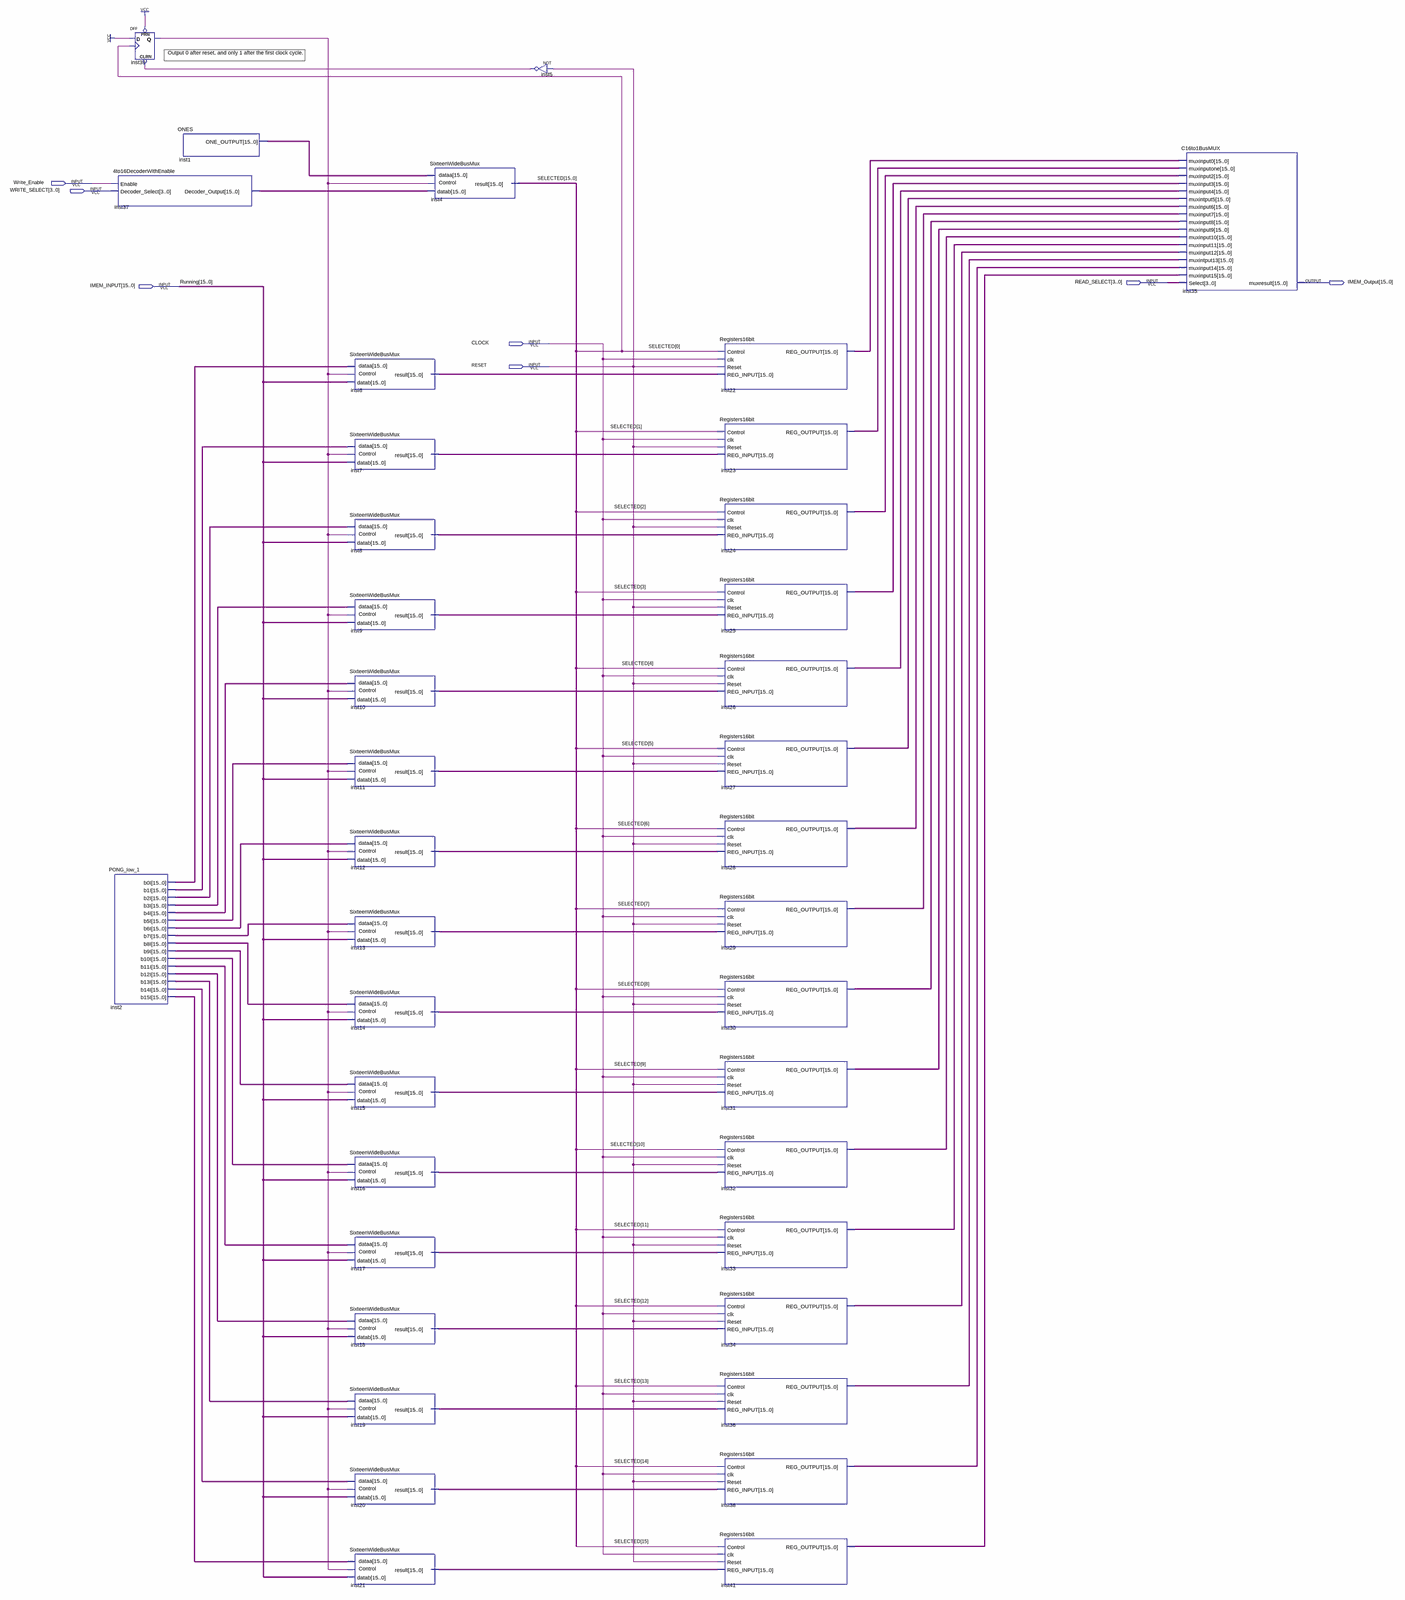
[diagram p0: schematic sheet, whole]
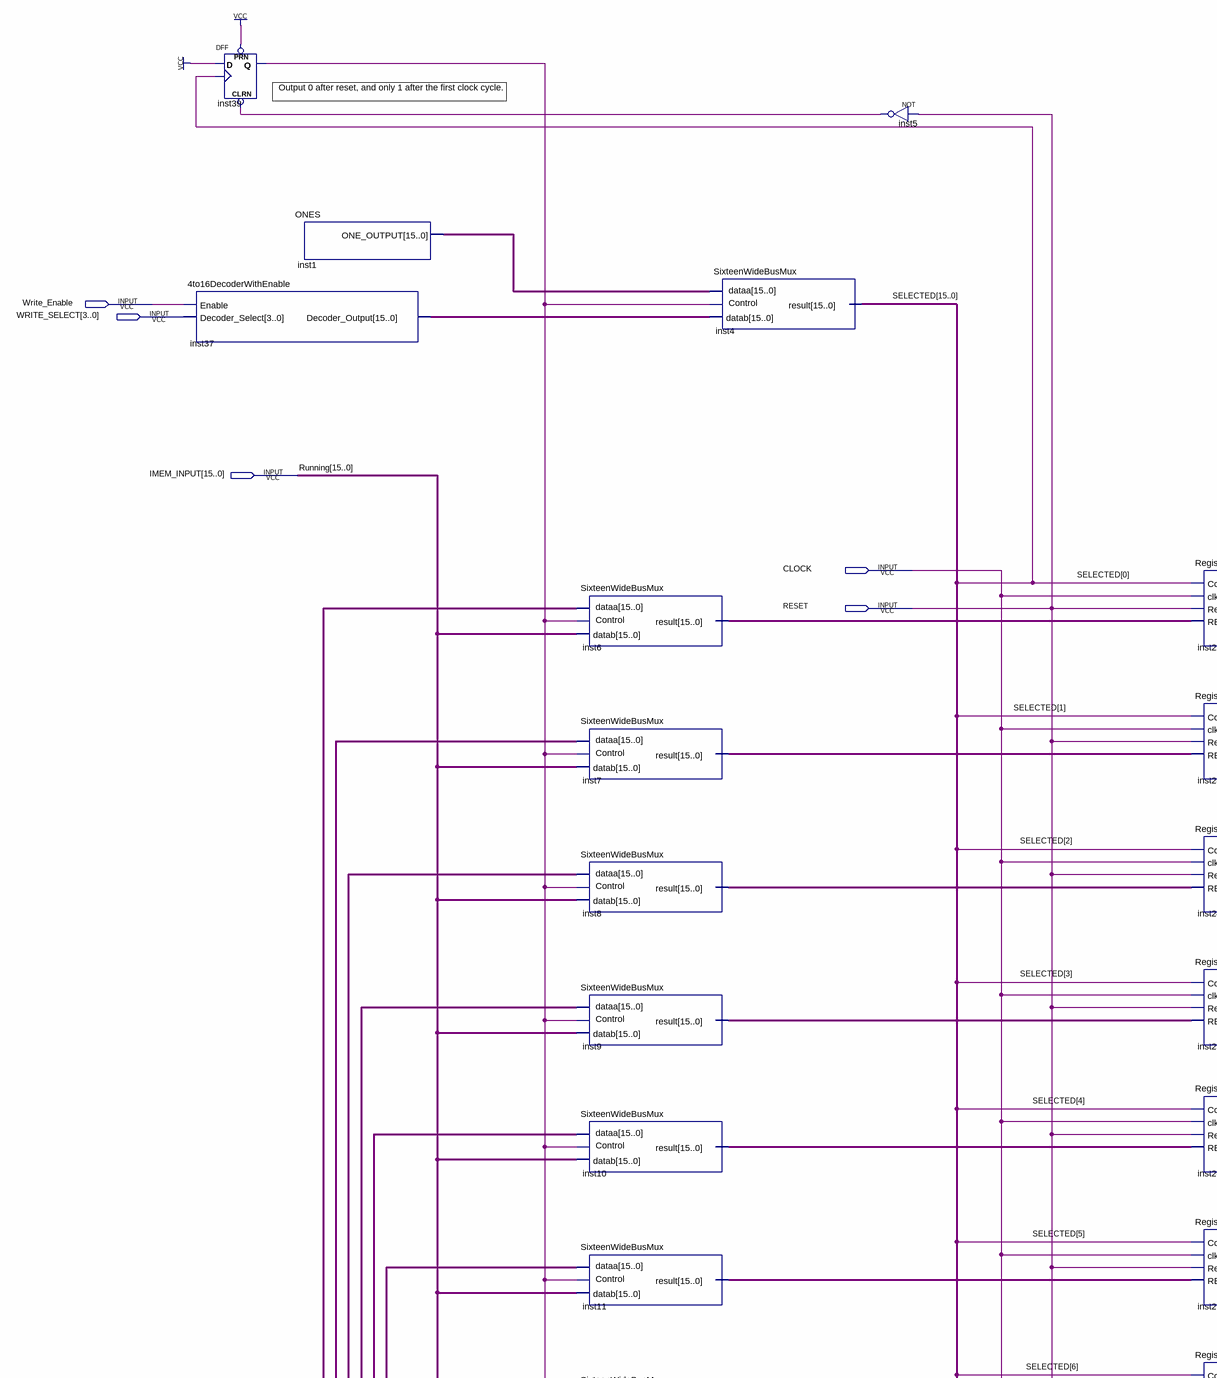
[diagram p1: schematic sheet, upper left part]
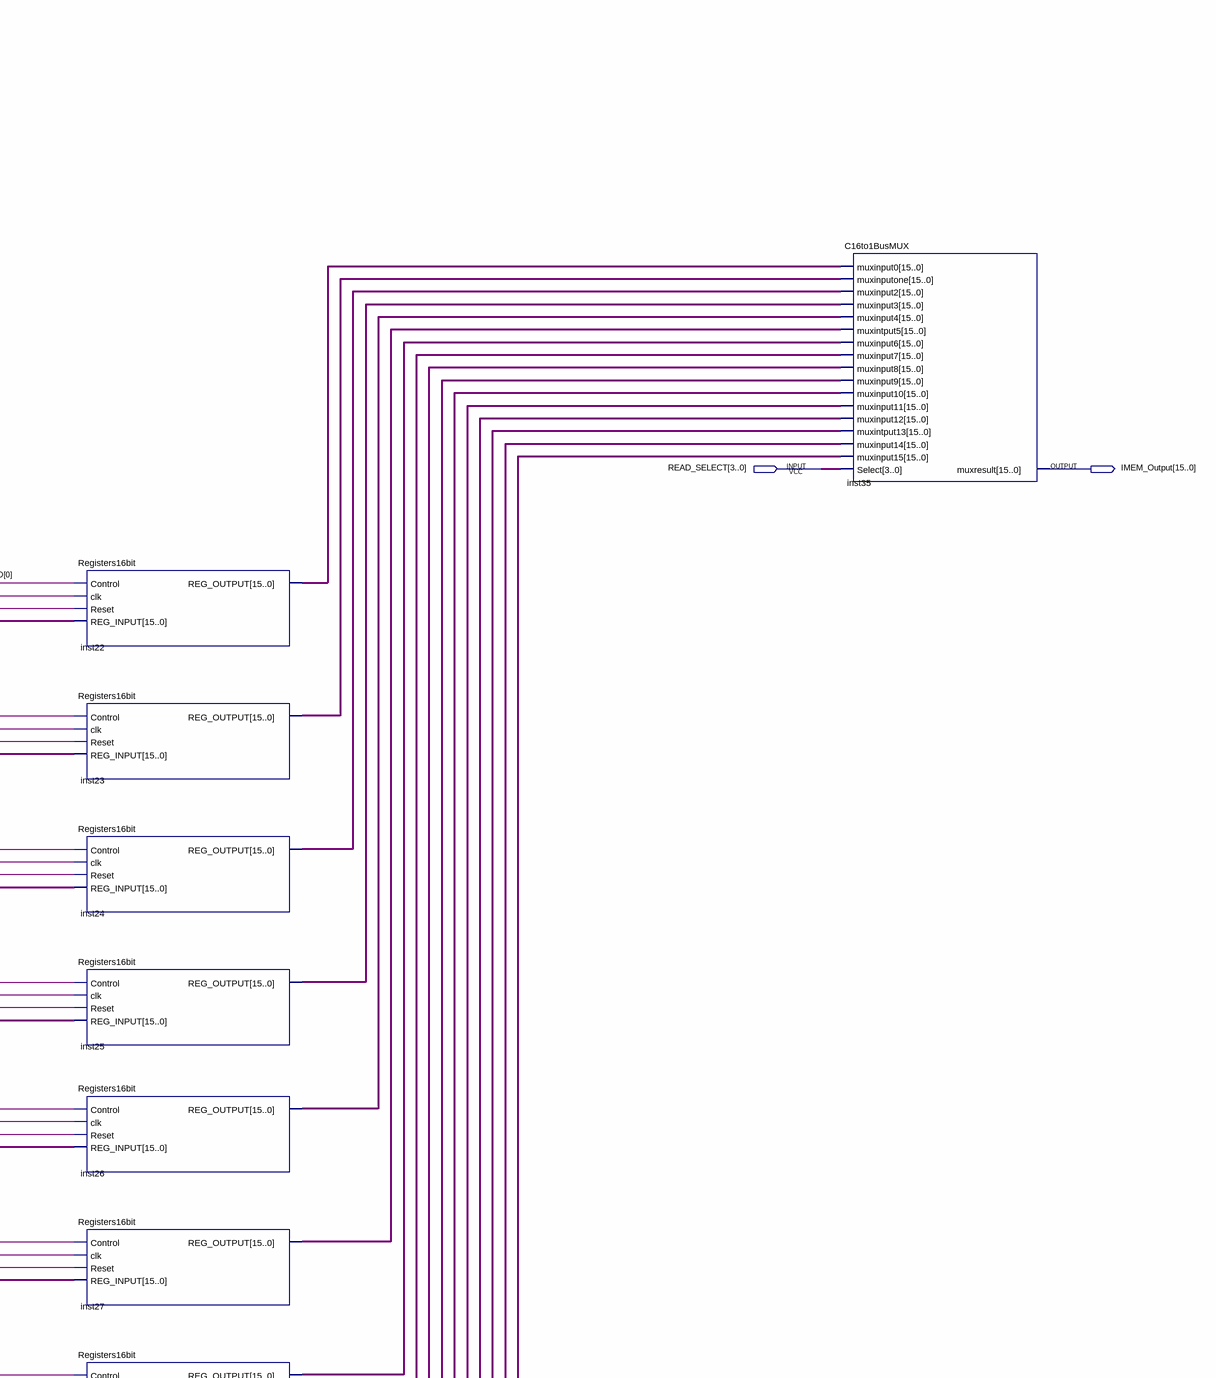
[diagram p2: schematic sheet, upper right part]
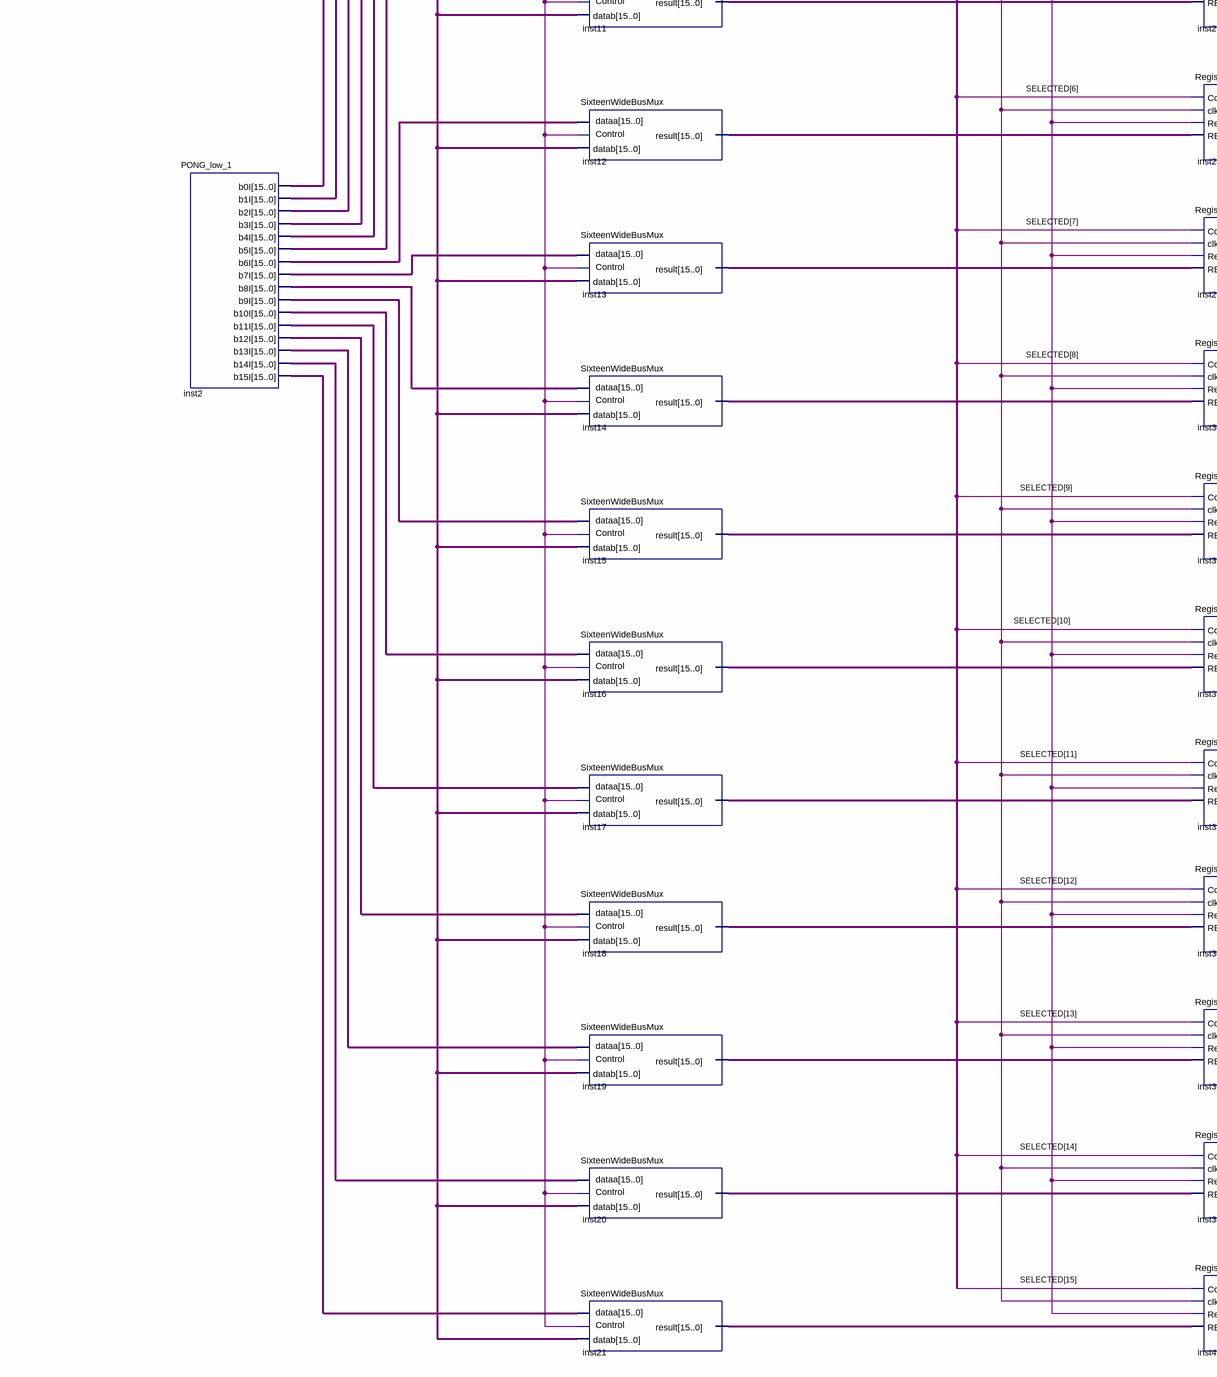
[diagram p3: schematic sheet, lower left part]
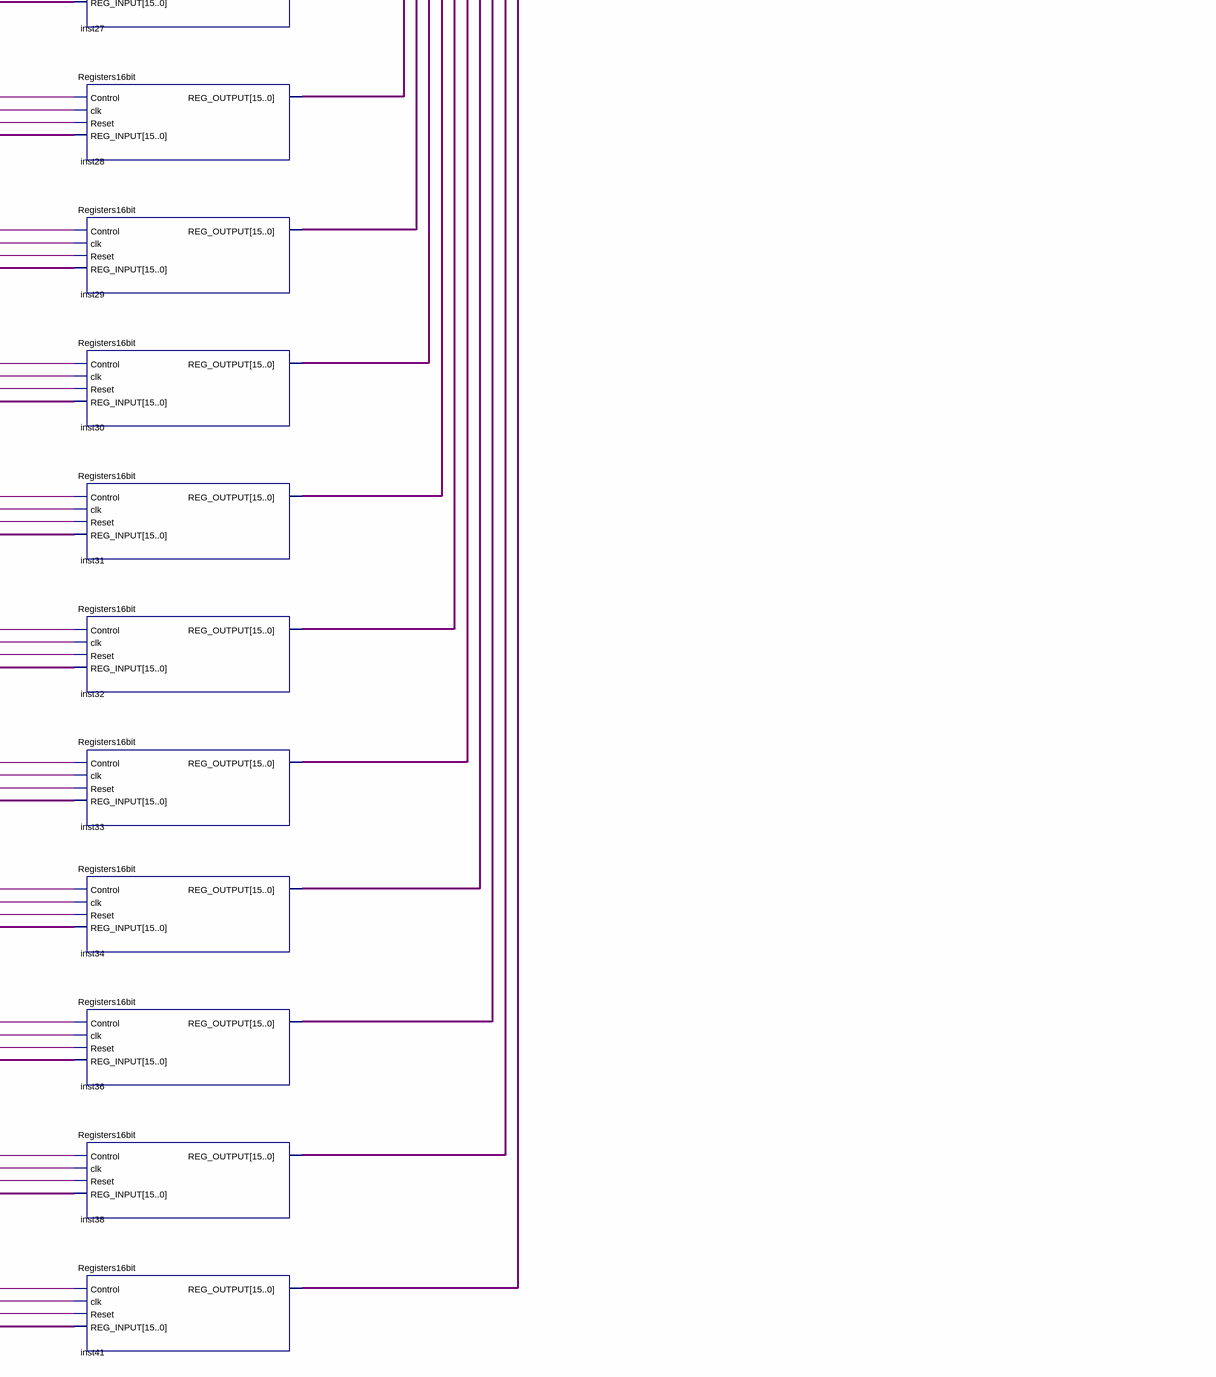
[diagram p4: schematic sheet, lower right part]
// Quartus schematic ReadOnly_16x16_Register_File_Low.bdf as structural Verilog: 39 symbols, 7 pins
module ReadOnly_16x16_Register_File_Low (
  input  Write_Enable,
  input  [3:0] WRITE_SELECT,
  input  [3:0] READ_SELECT,
  input  [15:0] IMEM_INPUT,
  input  CLOCK,
  input  RESET,
  output [15:0] IMEM_Output
);

  wire inst5_out, inst39_q;
  wire [15:0] inst1_one_output, inst2_b0i, inst2_b1i, inst2_b2i, inst2_b3i, inst2_b4i, inst2_b5i, inst2_b6i,
       inst2_b7i, inst2_b8i, inst2_b9i, inst2_b10i, inst2_b11i, inst2_b12i, inst2_b13i, inst2_b14i,
       inst2_b15i, inst6_result, inst7_result, inst8_result, inst9_result, inst10_result, inst11_result,
       inst12_result, inst13_result, inst14_result, inst15_result, inst16_result, inst17_result,
       inst18_result, inst19_result, inst20_result, inst21_result, inst22_reg_output, inst23_reg_output,
       inst24_reg_output, inst25_reg_output, inst26_reg_output, inst27_reg_output, inst28_reg_output,
       inst29_reg_output, inst30_reg_output, inst31_reg_output, inst32_reg_output, inst33_reg_output,
       inst34_reg_output, inst36_reg_output, inst37_decoder_output, inst38_reg_output, inst41_reg_output,
       SELECTED;

  \4to16DecoderWithEnable  inst37 (
    .Enable(Write_Enable), .Decoder_Select(WRITE_SELECT), .Decoder_Output(inst37_decoder_output));
  PONG_low_1 inst2 (
    .b0I(inst2_b0i), .b1I(inst2_b1i), .b2I(inst2_b2i), .b3I(inst2_b3i), .b4I(inst2_b4i), .b5I(inst2_b5i),
    .b6I(inst2_b6i), .b7I(inst2_b7i), .b8I(inst2_b8i), .b9I(inst2_b9i), .b10I(inst2_b10i), .b11I(inst2_b11i),
    .b12I(inst2_b12i), .b13I(inst2_b13i), .b14I(inst2_b14i), .b15I(inst2_b15i));
  DFF inst39 (.CLRN(inst5_out), .CLK(SELECTED[0]), .D(1'b1), .PRN(1'b1), .Q(inst39_q));
  ONES inst1 (.ONE_OUTPUT(inst1_one_output));
  SixteenWideBusMux inst6 (.Control(inst39_q), .dataa(inst2_b0i), .datab(IMEM_INPUT), .result(inst6_result));
  SixteenWideBusMux inst7 (.Control(inst39_q), .dataa(inst2_b1i), .datab(IMEM_INPUT), .result(inst7_result));
  SixteenWideBusMux inst8 (.Control(inst39_q), .dataa(inst2_b2i), .datab(IMEM_INPUT), .result(inst8_result));
  SixteenWideBusMux inst9 (.Control(inst39_q), .dataa(inst2_b3i), .datab(IMEM_INPUT), .result(inst9_result));
  SixteenWideBusMux inst10 (.Control(inst39_q), .dataa(inst2_b4i), .datab(IMEM_INPUT), .result(inst10_result));
  SixteenWideBusMux inst11 (.Control(inst39_q), .dataa(inst2_b5i), .datab(IMEM_INPUT), .result(inst11_result));
  SixteenWideBusMux inst12 (.Control(inst39_q), .dataa(inst2_b6i), .datab(IMEM_INPUT), .result(inst12_result));
  SixteenWideBusMux inst13 (.Control(inst39_q), .dataa(inst2_b7i), .datab(IMEM_INPUT), .result(inst13_result));
  SixteenWideBusMux inst14 (.Control(inst39_q), .dataa(inst2_b8i), .datab(IMEM_INPUT), .result(inst14_result));
  SixteenWideBusMux inst15 (.Control(inst39_q), .dataa(inst2_b9i), .datab(IMEM_INPUT), .result(inst15_result));
  SixteenWideBusMux inst16 (.Control(inst39_q), .dataa(inst2_b10i), .datab(IMEM_INPUT), .result(inst16_result));
  SixteenWideBusMux inst17 (.Control(inst39_q), .dataa(inst2_b11i), .datab(IMEM_INPUT), .result(inst17_result));
  SixteenWideBusMux inst18 (.Control(inst39_q), .dataa(inst2_b12i), .datab(IMEM_INPUT), .result(inst18_result));
  SixteenWideBusMux inst19 (.Control(inst39_q), .dataa(inst2_b13i), .datab(IMEM_INPUT), .result(inst19_result));
  SixteenWideBusMux inst20 (.Control(inst39_q), .dataa(inst2_b14i), .datab(IMEM_INPUT), .result(inst20_result));
  SixteenWideBusMux inst21 (.Control(inst39_q), .dataa(inst2_b15i), .datab(IMEM_INPUT), .result(inst21_result));
  SixteenWideBusMux inst4 (
    .Control(inst39_q), .dataa(inst1_one_output), .datab(inst37_decoder_output), .result(SELECTED));
  not inst5 (inst5_out, RESET);
  Registers16bit inst22 (
    .Control(SELECTED[0]), .clk(CLOCK), .Reset(RESET), .REG_INPUT(inst6_result),
    .REG_OUTPUT(inst22_reg_output));
  Registers16bit inst23 (
    .Control(SELECTED[1]), .clk(CLOCK), .Reset(RESET), .REG_INPUT(inst7_result),
    .REG_OUTPUT(inst23_reg_output));
  Registers16bit inst24 (
    .Control(SELECTED[2]), .clk(CLOCK), .Reset(RESET), .REG_INPUT(inst8_result),
    .REG_OUTPUT(inst24_reg_output));
  Registers16bit inst25 (
    .Control(SELECTED[3]), .clk(CLOCK), .Reset(RESET), .REG_INPUT(inst9_result),
    .REG_OUTPUT(inst25_reg_output));
  Registers16bit inst26 (
    .Control(SELECTED[4]), .clk(CLOCK), .Reset(RESET), .REG_INPUT(inst10_result),
    .REG_OUTPUT(inst26_reg_output));
  Registers16bit inst27 (
    .Control(SELECTED[5]), .clk(CLOCK), .Reset(RESET), .REG_INPUT(inst11_result),
    .REG_OUTPUT(inst27_reg_output));
  Registers16bit inst28 (
    .Control(SELECTED[6]), .clk(CLOCK), .Reset(RESET), .REG_INPUT(inst12_result),
    .REG_OUTPUT(inst28_reg_output));
  Registers16bit inst29 (
    .Control(SELECTED[7]), .clk(CLOCK), .Reset(RESET), .REG_INPUT(inst13_result),
    .REG_OUTPUT(inst29_reg_output));
  Registers16bit inst30 (
    .Control(SELECTED[8]), .clk(CLOCK), .Reset(RESET), .REG_INPUT(inst14_result),
    .REG_OUTPUT(inst30_reg_output));
  Registers16bit inst31 (
    .Control(SELECTED[9]), .clk(CLOCK), .Reset(RESET), .REG_INPUT(inst15_result),
    .REG_OUTPUT(inst31_reg_output));
  Registers16bit inst32 (
    .Control(SELECTED[10]), .clk(CLOCK), .Reset(RESET), .REG_INPUT(inst16_result),
    .REG_OUTPUT(inst32_reg_output));
  Registers16bit inst33 (
    .Control(SELECTED[11]), .clk(CLOCK), .Reset(RESET), .REG_INPUT(inst17_result),
    .REG_OUTPUT(inst33_reg_output));
  Registers16bit inst34 (
    .Control(SELECTED[12]), .clk(CLOCK), .Reset(RESET), .REG_INPUT(inst18_result),
    .REG_OUTPUT(inst34_reg_output));
  Registers16bit inst36 (
    .Control(SELECTED[13]), .clk(CLOCK), .Reset(RESET), .REG_INPUT(inst19_result),
    .REG_OUTPUT(inst36_reg_output));
  Registers16bit inst38 (
    .Control(SELECTED[14]), .clk(CLOCK), .Reset(RESET), .REG_INPUT(inst20_result),
    .REG_OUTPUT(inst38_reg_output));
  Registers16bit inst41 (
    .Control(SELECTED[15]), .clk(CLOCK), .Reset(RESET), .REG_INPUT(inst21_result),
    .REG_OUTPUT(inst41_reg_output));
  C16to1BusMUX inst35 (
    .muxinput0(inst22_reg_output), .muxinputone(inst23_reg_output), .muxinput2(inst24_reg_output),
    .muxinput3(inst25_reg_output), .muxinput4(inst26_reg_output), .muxintput5(inst27_reg_output),
    .muxinput6(inst28_reg_output), .muxinput7(inst29_reg_output), .muxinput8(inst30_reg_output),
    .muxinput9(inst31_reg_output), .muxinput10(inst32_reg_output), .muxinput11(inst33_reg_output),
    .muxinput12(inst34_reg_output), .muxintput13(inst36_reg_output), .muxinput14(inst38_reg_output),
    .muxinput15(inst41_reg_output), .Select(READ_SELECT), .muxresult(IMEM_Output));

  // Other names for the same wires on the sheet: Running[15:0] = IMEM_INPUT

  // Notes on the sheet:
  //   Output 0 after reset, and only 1 after the first clock cycle.
endmodule
